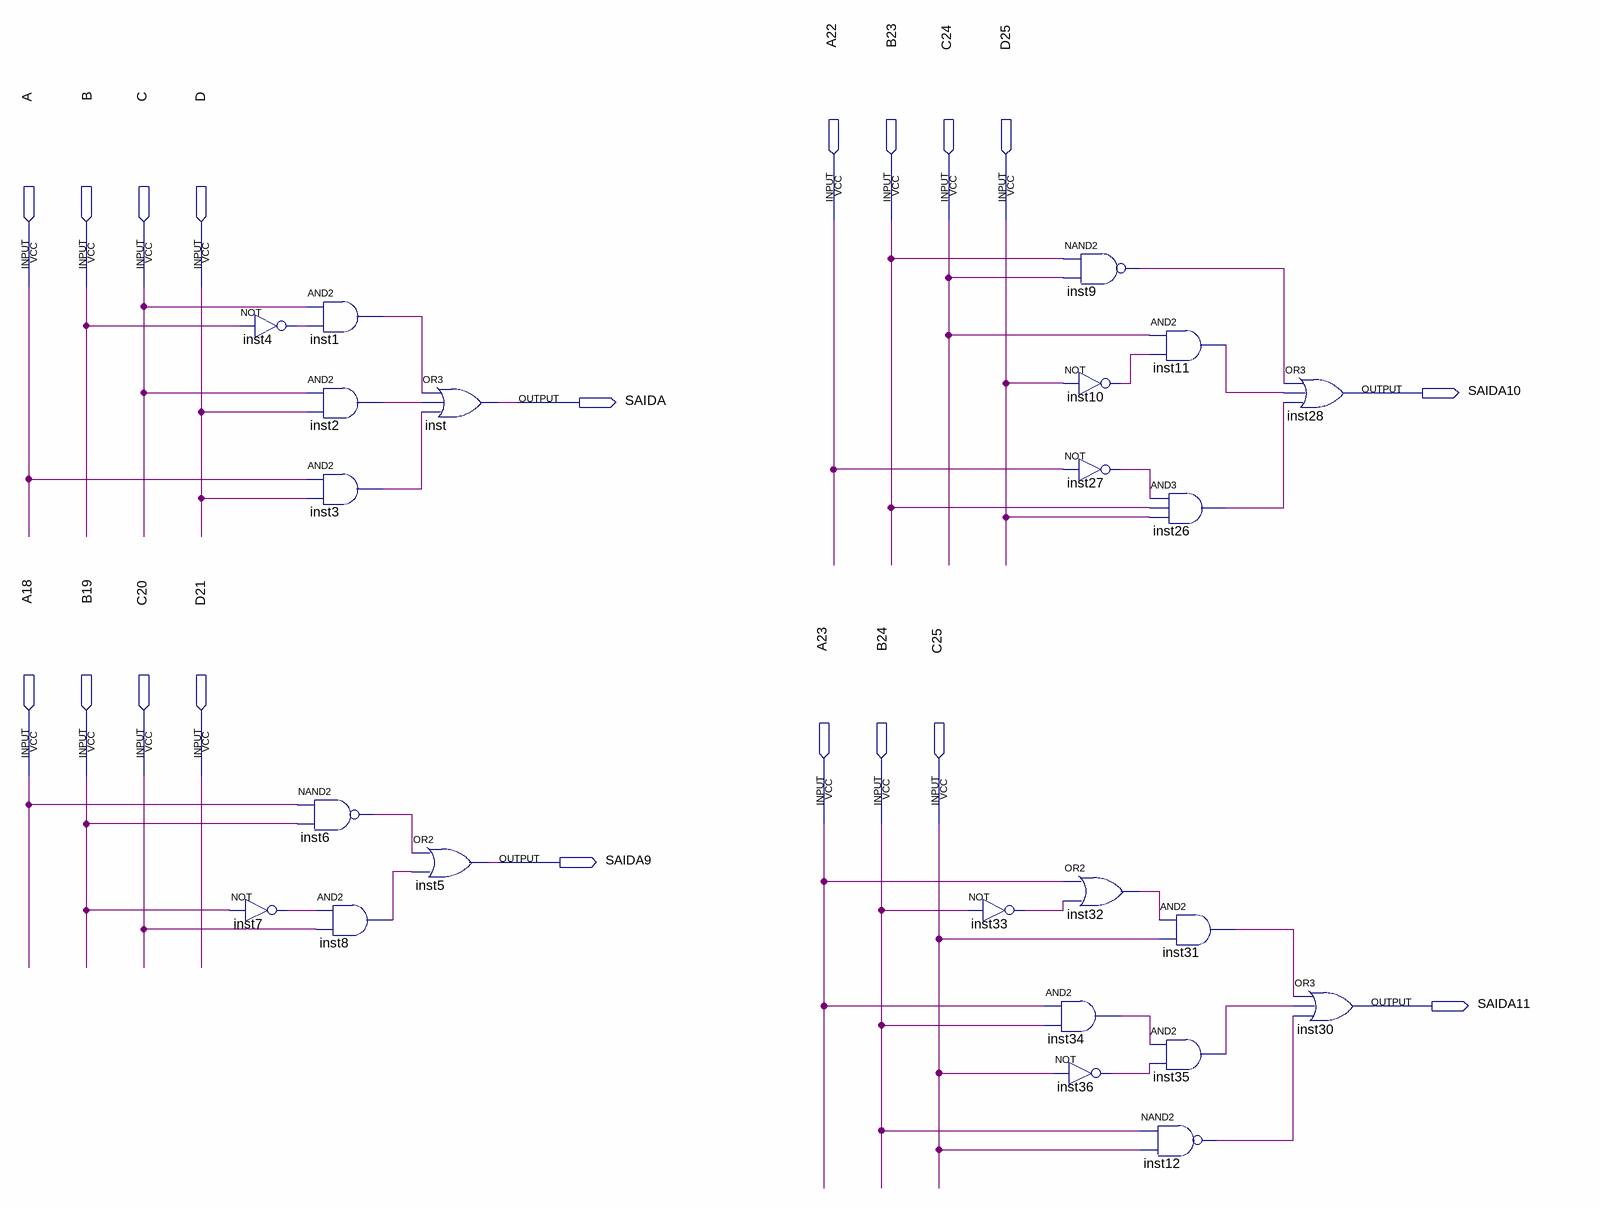
[diagram p0: schematic sheet]
// Quartus schematic exerc01a.bdf as structural Verilog: 23 symbols, 19 pins
module exerc01a (
  input  A22,
  input  B23,
  input  C24,
  input  D25,
  input  A,
  input  B,
  input  C,
  input  D,
  input  A18,
  input  B19,
  input  C20,
  input  D21,
  input  A23,
  input  B24,
  input  C25,
  output SAIDA10,
  output SAIDA,
  output SAIDA9,
  output SAIDA11
);

  wire inst1_out, inst2_out, inst3_out, inst4_out, inst6_out, inst7_out, inst8_out, inst9_out, inst10_out,
       inst11_out, inst12_out, inst26_out, inst27_out, inst31_out, inst32_out, inst33_out, inst34_out,
       inst35_out, inst36_out;

  not inst7 (inst7_out, B19);
  and inst1 (inst1_out, C, inst4_out);
  not inst4 (inst4_out, B);
  and inst2 (inst2_out, C, D);
  and inst3 (inst3_out, A, D);
  nand inst6 (inst6_out, A18, B19);
  and inst8 (inst8_out, inst7_out, C20);
  or inst (SAIDA, inst1_out, inst2_out, inst3_out);
  or inst5 (SAIDA9, inst6_out, inst8_out);
  not inst33 (inst33_out, B24);
  nand inst9 (inst9_out, B23, C24);
  not inst10 (inst10_out, D25);
  not inst27 (inst27_out, A22);
  or inst32 (inst32_out, A23, inst33_out);
  and inst34 (inst34_out, A23, B24);
  not inst36 (inst36_out, C25);
  and inst11 (inst11_out, C24, inst10_out);
  and inst26 (inst26_out, inst27_out, B23, D25);
  and inst35 (inst35_out, inst34_out, inst36_out);
  nand inst12 (inst12_out, B24, C25);
  and inst31 (inst31_out, inst32_out, C25);
  or inst28 (SAIDA10, inst9_out, inst11_out, inst26_out);
  or inst30 (SAIDA11, inst31_out, inst35_out, inst12_out);
endmodule
